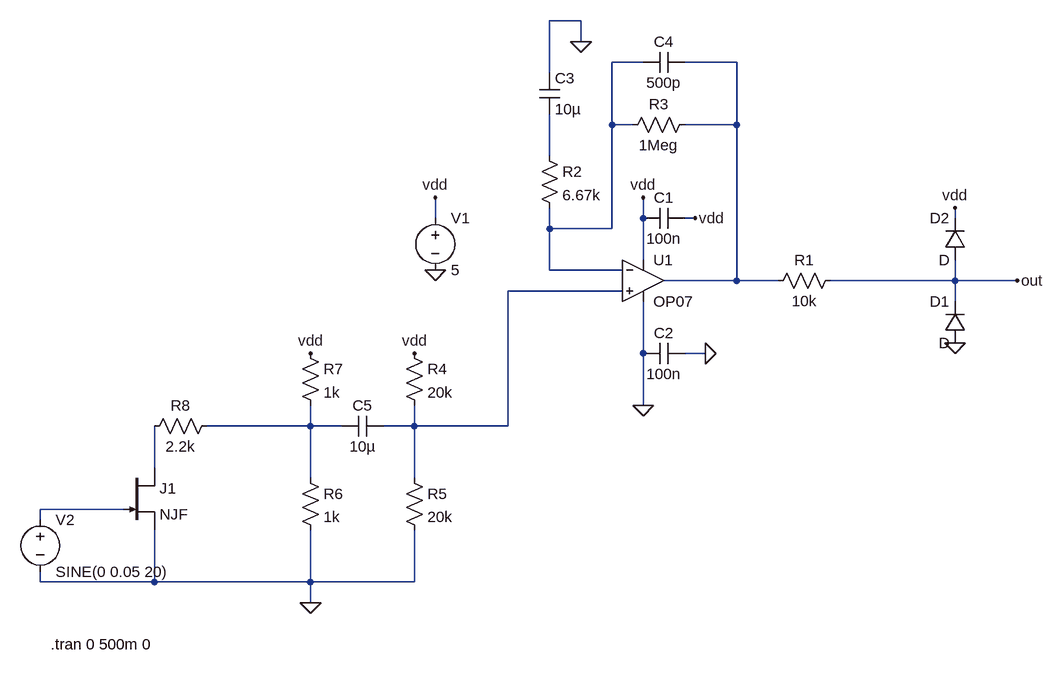
[diagram p0: schematic esdp.asc]
esdp.asc, the LTspice schematic file:
Version 4
SHEET 1 880 752
WIRE 112 -224 64 -224
WIRE 112 -192 112 -224
WIRE 208 -160 160 -160
WIRE 352 -160 272 -160
WIRE 64 -144 64 -224
WIRE 160 -64 160 -160
WIRE 192 -64 160 -64
WIRE 352 -64 352 -160
WIRE 352 -64 272 -64
WIRE 64 -16 64 -80
WIRE -112 80 -112 48
WIRE 208 80 208 48
WIRE 288 80 272 80
WIRE 688 80 688 64
WIRE 64 96 64 64
WIRE 160 96 160 -64
WIRE 160 96 64 96
WIRE 208 144 208 80
WIRE 64 160 64 96
WIRE 176 160 64 160
WIRE 352 176 352 -64
WIRE 352 176 240 176
WIRE 416 176 352 176
WIRE 688 176 688 144
WIRE 688 176 496 176
WIRE 784 176 688 176
WIRE 176 192 0 192
WIRE 688 208 688 176
WIRE 208 288 208 208
WIRE 304 288 272 288
WIRE 208 368 208 288
WIRE -304 400 -304 368
WIRE -304 400 -464 400
WIRE -256 400 -304 400
WIRE -144 400 -144 368
WIRE -144 400 -192 400
WIRE 0 400 0 192
WIRE 0 400 -144 400
WIRE -544 464 -544 400
WIRE -304 480 -304 400
WIRE -144 480 -144 400
WIRE -592 528 -720 528
WIRE -720 544 -720 528
WIRE -720 640 -720 624
WIRE -544 640 -544 560
WIRE -544 640 -720 640
WIRE -304 640 -304 560
WIRE -304 640 -544 640
WIRE -144 640 -144 560
WIRE -144 640 -304 640
WIRE -304 672 -304 640
FLAG -112 160 0
FLAG -112 48 vdd
FLAG 208 48 vdd
FLAG 208 368 0
FLAG 304 288 0
FLAG 288 80 vdd
FLAG 688 272 0
FLAG 688 64 vdd
FLAG 112 -192 0
FLAG -144 288 vdd
FLAG -304 672 0
FLAG -304 288 vdd
FLAG 784 176 out
SYMBOL OpAmps\\OP07 208 112 R0
SYMATTR InstName U1
SYMBOL voltage -112 64 R0
WINDOW 123 0 0 Left 0
WINDOW 39 0 0 Left 0
SYMATTR InstName V1
SYMATTR Value 5
SYMBOL cap 272 64 R90
WINDOW 0 0 32 VBottom 2
WINDOW 3 32 32 VTop 2
SYMATTR InstName C1
SYMATTR Value 100n
SYMBOL cap 272 272 R90
WINDOW 0 0 32 VBottom 2
WINDOW 3 32 32 VTop 2
SYMATTR InstName C2
SYMATTR Value 100n
SYMBOL res 512 160 R90
WINDOW 0 0 56 VBottom 2
WINDOW 3 32 56 VTop 2
SYMATTR InstName R1
SYMATTR Value 10k
SYMBOL diode 704 272 R180
WINDOW 0 24 64 Left 2
WINDOW 3 24 0 Left 2
SYMATTR InstName D1
SYMBOL diode 704 144 R180
WINDOW 0 24 64 Left 2
WINDOW 3 24 0 Left 2
SYMATTR InstName D2
SYMBOL res 48 -32 R0
SYMATTR InstName R2
SYMATTR Value 6.67k
SYMBOL cap 48 -144 R0
SYMATTR InstName C3
SYMATTR Value 10µ
SYMBOL res 288 -80 R90
WINDOW 0 0 56 VBottom 2
WINDOW 3 32 56 VTop 2
SYMATTR InstName R3
SYMATTR Value 1Meg
SYMBOL cap 272 -176 R90
WINDOW 0 0 32 VBottom 2
WINDOW 3 32 32 VTop 2
SYMATTR InstName C4
SYMATTR Value 500p
SYMBOL res -160 272 R0
SYMATTR InstName R4
SYMATTR Value 20k
SYMBOL res -160 464 R0
SYMATTR InstName R5
SYMATTR Value 20k
SYMBOL cap -192 384 R90
WINDOW 0 0 32 VBottom 2
WINDOW 3 32 32 VTop 2
SYMATTR InstName C5
SYMATTR Value 10µ
SYMBOL res -320 464 R0
SYMATTR InstName R6
SYMATTR Value 1k
SYMBOL res -320 272 R0
SYMATTR InstName R7
SYMATTR Value 1k
SYMBOL res -448 384 R90
WINDOW 0 0 56 VBottom 2
WINDOW 3 32 56 VTop 2
SYMATTR InstName R8
SYMATTR Value 2.2k
SYMBOL njf -592 464 R0
SYMATTR InstName J1
SYMBOL voltage -720 528 R0
WINDOW 123 24 124 Left 2
WINDOW 39 0 0 Left 0
SYMATTR InstName V2
SYMATTR Value SINE(0 0.05 20)
TEXT -704 736 Left 2 !.tran 0 500m 0

The netlist it stands for:
* esdp.asc
XU1 N004 N001 vdd 0 N002 LT1001  ; OP07, pins In+ In- V+ V- OUT
V1 vdd 0 5
C1 vdd vdd 100n
C2 0 0 100n
R1 out N002 10k
D1 0 out D
D2 out vdd D
R2 N003 N001 6.67k
C3 0 N003 10µ
R3 N002 N001 1Meg
C4 N002 N001 500p
R4 vdd N004 20k
R5 N004 0 20k
C5 N004 N005 10µ
R6 N005 0 1k
R7 vdd N005 1k
R8 N005 N006 2.2k
J1 N006 N007 0 NJF
V2 N007 0 SINE(0 0.05 20)
.model D D
.lib standard.dio
.model NJF NJF
.model PJF PJF
.lib standard.jft
.tran 0 500m 0
.lib LTC.lib
.backanno
.end